# Altium project USB2514_USB_HUB.PrjPcb
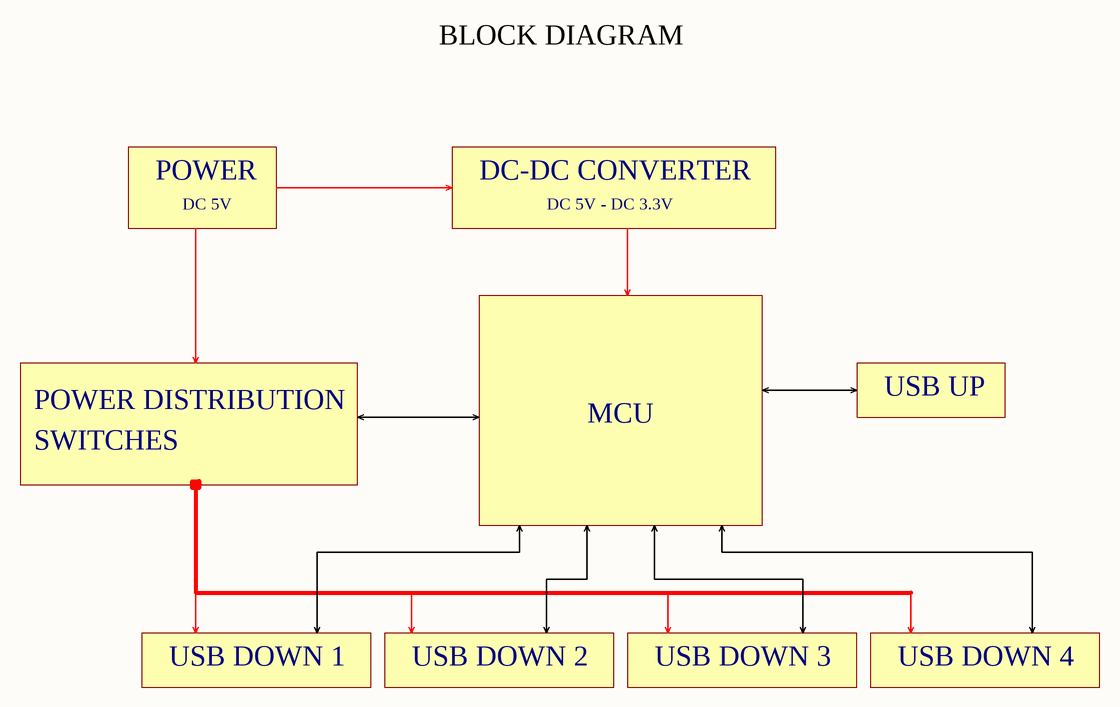
[diagram p0: USB2514 BLOCK DIAGRAM.SchDoc]
6 sheets, 61 parts. Net scope: global (net labels, ports and power ports of the same name join across sheets).
Board files: USB2514 PCB v1.PcbDoc, USB2514 PCB v2.PcbDoc
Sheets:
  USB2514 BLOCK DIAGRAM.SchDoc
  USB2514 MCU.SchDoc
  USB2514 USB PORTS.SchDoc
  USB2514 POWER DISTRIBUTION SWITCHES.SchDoc
  USB2514 REGULATOR.SchDoc
  USB2514 CRYSTAL.SchDoc

## Sheet USB2514 BLOCK DIAGRAM.SchDoc
size A4; DocumentNumber: 1; SheetNumber: 1; SheetTotal: 6

### Notes on the sheet
- BLOCK DIAGRAM
- POWER
- DC-DC CONVERTER
- DC 5V
- DC 5V - DC 3.3V
- USB UP
- POWER DISTRIBUTION
- SWITCHES
- MCU
- USB DOWN 1
- USB DOWN 2
- USB DOWN 3
- USB DOWN 4

## Sheet USB2514 MCU.SchDoc: asdasdasd
size A4; DocumentNumber: 2; SheetNumber: 2; SheetTotal: 6
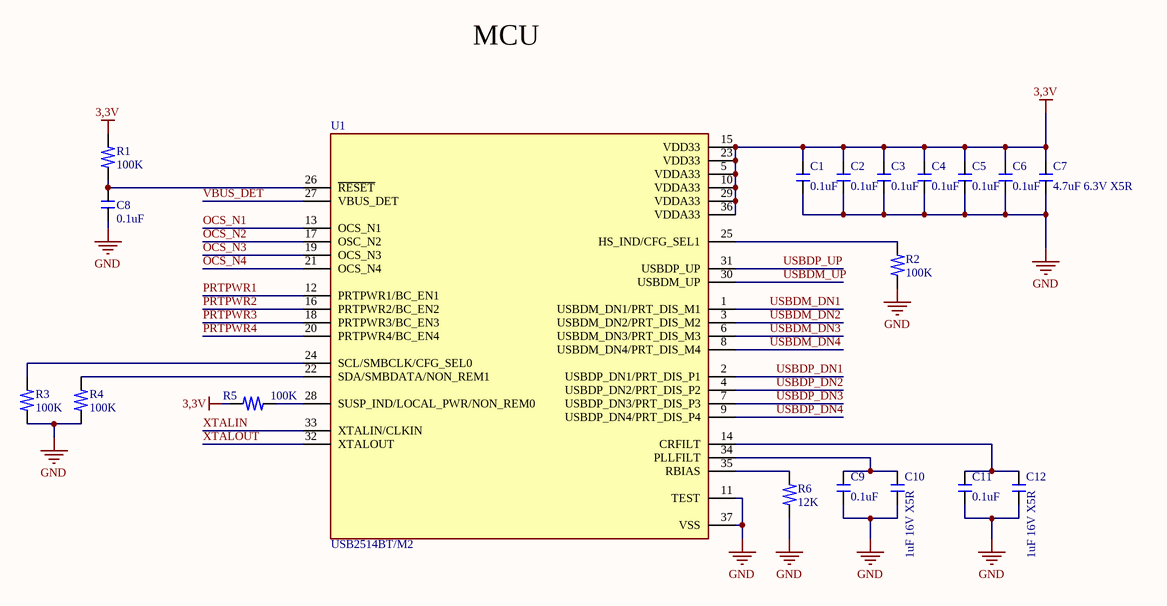
[diagram p1: USB2514 MCU.SchDoc]

### Parts
C1  0.1uF  [CAPC1608X06N-0603]
C2  0.1uF  [CAPC1608X06N-0603]
C3  0.1uF  [CAPC1608X06N-0603]
C4  0.1uF  [CAPC1608X06N-0603]
C5  0.1uF  [CAPC1608X06N-0603]
C6  0.1uF  [CAPC1608X06N-0603]
C7  4.7uF 6.3V X5R  [CAPC1608X06N-0603]
C8  0.1uF  [CAPC1608X06N-0603]
C9  0.1uF  [CAPC1608X06N-0603]
C10  1uF 16V X5R  [CAPC1608X06N-0603]
C11  0.1uF  [CAPC1608X06N-0603]
C12  1uF 16V X5R  [CAPC1608X06N-0603]
R1  100K  [RESC1608X06N-0603]
R2  100K  [RESC1608X06N-0603]
R3  100K  [RESC1608X06N-0603]
R4  100K  [RESC1608X06N-0603]
R5  100K  [RESC1608X06N-0603]
R6  12K  [RESC1608X06N-0603]
U1  USB2514BT/M2  [QFN50P600X600X100_HS-37N]

### Nets
3,3V: C1.2 C2.2 C3.2 C4.2 C5.2 C6.2 C7.2 R1.2 R5.2 U1.5(VDDA33) U1.10(VDDA33) U1.15(VDD33) U1.23(VDD33) U1.29(VDDA33) U1.36(VDDA33)
GND: C1.1 C2.1 C3.1 C4.1 C5.1 C6.1 C7.1 C8.1 C9.1 C10.1 C11.1 C12.1 R2.1 R3.1 R4.1 R6.1 U1.11(TEST) U1.37(VSS)
OCS_N1: U1.13(OCS_N1)
OCS_N2: U1.17(OSC_N2)
OCS_N3: U1.19(OCS_N3)
OCS_N4: U1.21(OCS_N4)
PRTPWR1: U1.12(PRTPWR1/BC_EN1)
PRTPWR2: U1.16(PRTPWR2/BC_EN2)
PRTPWR3: U1.18(PRTPWR3/BC_EN3)
PRTPWR4: U1.20(PRTPWR4/BC_EN4)
USBDM_DN1: U1.1(USBDM_DN1/PRT_DIS_M1)
USBDM_DN2: U1.3(USBDM_DN2/PRT_DIS_M2)
USBDM_DN3: U1.6(USBDM_DN3/PRT_DIS_M3)
USBDM_DN4: U1.8(USBDM_DN4/PRT_DIS_M4)
USBDM_UP: U1.30(USBDM_UP)
USBDP_DN1: U1.2(USBDP_DN1/PRT_DIS_P1)
USBDP_DN2: U1.4(USBDP_DN2/PRT_DIS_P2)
USBDP_DN3: U1.7(USBDP_DN3/PRT_DIS_P3)
USBDP_DN4: U1.9(USBDP_DN4/PRT_DIS_P4)
USBDP_UP: U1.31(USBDP_UP)
VBUS_DET: U1.27(VBUS_DET)
XTALIN: U1.33(XTALIN/CLKIN)
XTALOUT: U1.32(XTALOUT)
NetC8_2: C8.2 R1.1 U1.26(~{RESET})
NetC9_2: C9.2 C10.2 U1.34(PLLFILT)
NetC11_2: C11.2 C12.2 U1.14(CRFILT)
NetR2_2: R2.2 U1.25(HS_IND/CFG_SEL1)
NetR3_2: R3.2 U1.24(SCL/SMBCLK/CFG_SEL0)
NetR4_2: R4.2 U1.22(SDA/SMBDATA/NON_REM1)
NetR5_1: R5.1 U1.28(SUSP_IND/LOCAL_PWR/NON_REM0)
NetR6_2: R6.2 U1.35(RBIAS)

### Notes on the sheet
- MCU

### Library data of the parts
C1-C12 = CAP_0603_0.1uF
R1-R6 = RES_0603_10K
U1 = USB2514BT/M2: USB Hub Controller USB Interface 36-SQFN (6x6); MF: Microchip; Purchase-URL: https://pricing.snapeda.com/search/part/USB2514BT/M2/?ref=eda; Package: VFQFN-36 Microchip; MP: USB2514BT/M2; Check_prices: https://www.snapeda.com/parts/USB2514BT/M2/Microchip/view-part/1051251/?ref=eda; Price: None; SnapEDA_Link: https://www.snapeda.com/parts/USB2514BT/M2/Microchip/view-part/1051251/?ref=snap; Availability: Warning; Value: *

## Sheet USB2514 USB PORTS.SchDoc
size A4; DocumentNumber: 3; SheetNumber: 3; SheetTotal: 6
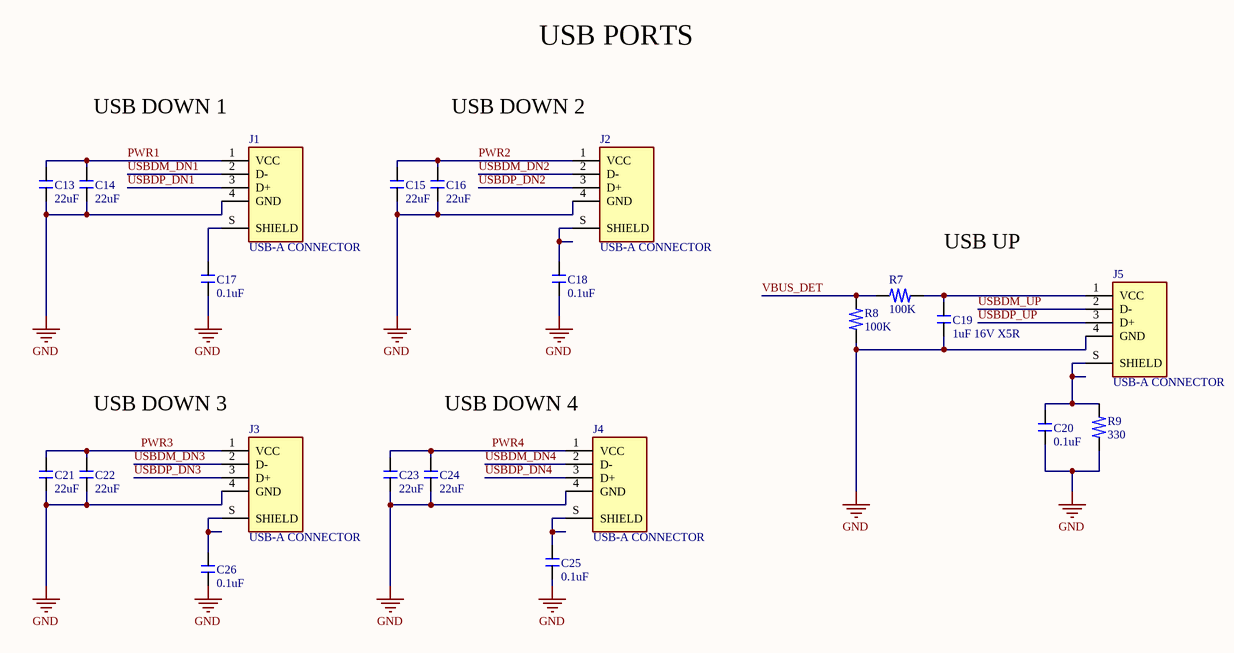
[diagram p2: USB2514 USB PORTS.SchDoc]

### Parts
C13  22uF  [CAPC3216X10N-1206]
C14  22uF  [CAPC3216X10N-1206]
C15  22uF  [CAPC3216X10N-1206]
C16  22uF  [CAPC3216X10N-1206]
C17  0.1uF  [CAPC1608X06N-0603]
C18  0.1uF  [CAPC1608X06N-0603]
C19  1uF 16V X5R  [CAPC1608X06N-0603]
C20  0.1uF  [CAPC1608X06N-0603]
C21  22uF  [CAPC3216X10N-1206]
C22  22uF  [CAPC3216X10N-1206]
C23  22uF  [CAPC3216X10N-1206]
C24  22uF  [CAPC3216X10N-1206]
C25  0.1uF  [CAPC1608X06N-0603]
C26  0.1uF  [CAPC1608X06N-0603]
J1  USB-A CONNECTOR  [USB-U-A-24DS-Y-1]
J2  USB-A CONNECTOR  [USB-U-A-24DS-Y-1]
J3  USB-A CONNECTOR  [USB-U-A-24DS-Y-1]
J4  USB-A CONNECTOR  [USB-U-A-24DS-Y-1]
J5  USB-A CONNECTOR  [USB-U-A-24DS-Y-1]
R7  100K  [RESC1608X06N-0603]
R8  100K  [RESC1608X06N-0603]
R9  330  [RESC1608X06N-0603]

### Nets
GND: C13.1 C14.1 C15.1 C16.1 C17.1 C18.1 C19.1 C20.1 C21.1 C22.1 C23.1 C24.1 C25.1 C26.1 J1.4(GND) J2.4(GND) J3.4(GND) J4.4(GND) J5.4(GND) R8.1 R9.1
PWR1: C13.2 C14.2 J1.1(VCC)
PWR2: C15.2 C16.2 J2.1(VCC)
PWR3: C21.2 C22.2 J3.1(VCC)
PWR4: C23.2 C24.2 J4.1(VCC)
USBDM_DN1: J1.2(D-)
USBDM_DN2: J2.2(D-)
USBDM_DN3: J3.2(D-)
USBDM_DN4: J4.2(D-)
USBDM_UP: J5.2(D-)
USBDP_DN1: J1.3(D+)
USBDP_DN2: J2.3(D+)
USBDP_DN3: J3.3(D+)
USBDP_DN4: J4.3(D+)
USBDP_UP: J5.3(D+)
VBUS_DET: R7.1 R8.2
NetC17_2: C17.2 J1.S(SHIELD)
NetC18_2: C18.2 J2.S(SHIELD)
NetC19_2: C19.2 J5.1(VCC) R7.2
NetC20_2: C20.2 J5.S(SHIELD) R9.2
NetC25_2: C25.2 J4.S(SHIELD)
NetC26_2: C26.2 J3.S(SHIELD)

### Notes on the sheet
- USB PORTS
- USB DOWN 1
- USB DOWN 2
- USB UP
- USB DOWN 3
- USB DOWN 4

### Library data of the parts
C13-C16 C21-C24 = CAP_1206_22uF
C17-C20 C25 C26 = CAP_0603_0.1uF
J1-J5 = USB-U-A-24DS-Y-1: USB-A (USB TYPE-A) USB 2.0; MF: Samtec; MP: USB-A-S-X-X-VU; Price: None; Availability: Unavailable; Value: *; Package: None
R7-R9 = RES_0603_1K

## Sheet USB2514 POWER DISTRIBUTION SWITCHES.SchDoc
size A4; DocumentNumber: 4; SheetNumber: 4; SheetTotal: 6
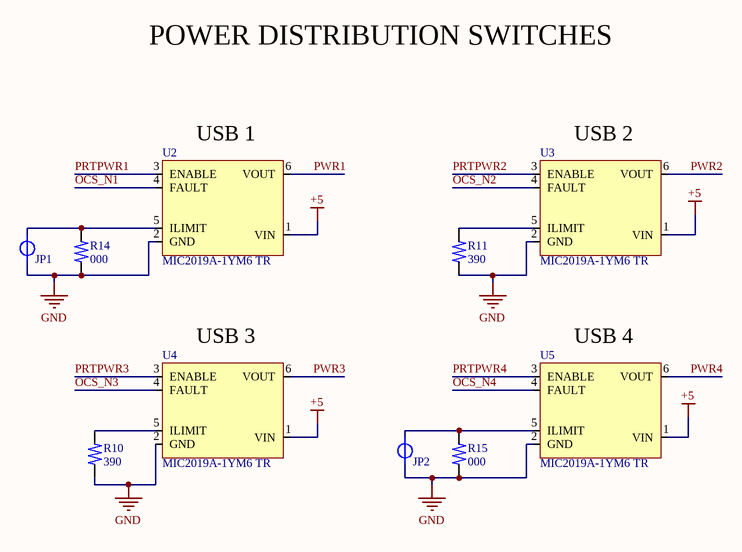
[diagram p3: USB2514 POWER DISTRIBUTION SWITCHES.SchDoc]

### Parts
JP1  JUMP_N-C  [JUMP_N-C 0,254]  (value not drawn)
JP2  JUMP_N-C  [JUMP_N-C 0,254]  (value not drawn)
R10  390  [RESC1608X06N-0603]
R11  390  [RESC1608X06N-0603]
R14  000  [RESC1608X06N-0603]
R15  000  [RESC1608X06N-0603]
U2  MIC2019A-1YM6 TR  [SOT95P280X90-6N]
U3  MIC2019A-1YM6 TR  [SOT95P280X90-6N]
U4  MIC2019A-1YM6 TR  [SOT95P280X90-6N]
U5  MIC2019A-1YM6 TR  [SOT95P280X90-6N]

### Nets
+5: U2.1(VIN) U3.1(VIN) U4.1(VIN) U5.1(VIN)
GND: JP1.1 JP2.1 R10.1 R11.1 R14.1 R15.1 U2.2(GND) U3.2(GND) U4.2(GND) U5.2(GND)
OCS_N1: U2.4(FAULT)
OCS_N2: U3.4(FAULT)
OCS_N3: U4.4(FAULT)
OCS_N4: U5.4(FAULT)
PRTPWR1: U2.3(ENABLE)
PRTPWR2: U3.3(ENABLE)
PRTPWR3: U4.3(ENABLE)
PRTPWR4: U5.3(ENABLE)
PWR1: U2.6(VOUT)
PWR2: U3.6(VOUT)
PWR3: U4.6(VOUT)
PWR4: U5.6(VOUT)
NetJP1_2: JP1.2 R14.2 U2.5(ILIMIT)
NetJP2_2: JP2.2 R15.2 U5.5(ILIMIT)
NetR10_2: R10.2 U4.5(ILIMIT)
NetR11_2: R11.2 U3.5(ILIMIT)

### Notes on the sheet
- POWER DISTRIBUTION SWITCHES
- (near U2) USB 1
- (near U3) USB 2
- (near U4) USB 3
- (near U5) USB 4

### Library data of the parts
R10 R11 R14 R15 = RES_0603_1K

## Sheet USB2514 REGULATOR.SchDoc
size A4; DocumentNumber: 5; SheetNumber: 5; SheetTotal: 6
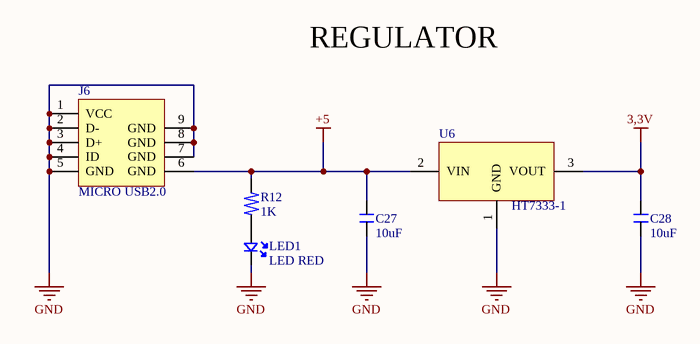
[diagram p4: USB2514 REGULATOR.SchDoc]

### Parts
C27  10uF  [CAPC3216X10N-1206]
C28  10uF  [CAPC3216X10N-1206]
J6  MICRO USB2.0  [USB_CON_10118192-0001LF_SMD]
LED1  LED RED  [LED_0603]
R12  1K  [RESC1608X06N-0603]
U6  HT7333-1  [SOT89-150P350X150-3N]

### Nets
3,3V: C28.2 U6.3(VOUT)
+5: C27.2 J6.6(GND) R12.2 U6.2(VIN)
GND: C27.1 C28.1 J6.1(VCC) J6.2(D-) J6.3(D+) J6.4(ID) J6.5(GND) J6.7(GND) J6.8(GND) J6.9(GND) LED1.C U6.1(GND)
NetLED1_A: LED1.A R12.1

### Notes on the sheet
- REGULATOR

### Library data of the parts
C27 C28 = CAP_1206_22uF
J6 = USB_CON-10118192-0002LF-SMD: USB - micro B USB 2.0 Receptacle Connector 5 Position Surface Mount, Right Angle; Manufacturer: Amphenol ICC (FCI); Manufacturing Part Number: 10118192-0002LF; Case/Package: SMD; Supplier-1: Digikey; Supplier Part Number-1: 609-5379-1-ND
LED1 = LED_RED_0603
R12 = RES_0603_1K
U6 = HT7333-1: HT7333-1 / 30V, 250mA TinyPowerTM LDO

## Sheet USB2514 CRYSTAL.SchDoc
size A4; DocumentNumber: 6; SheetNumber: 6; SheetTotal: 6
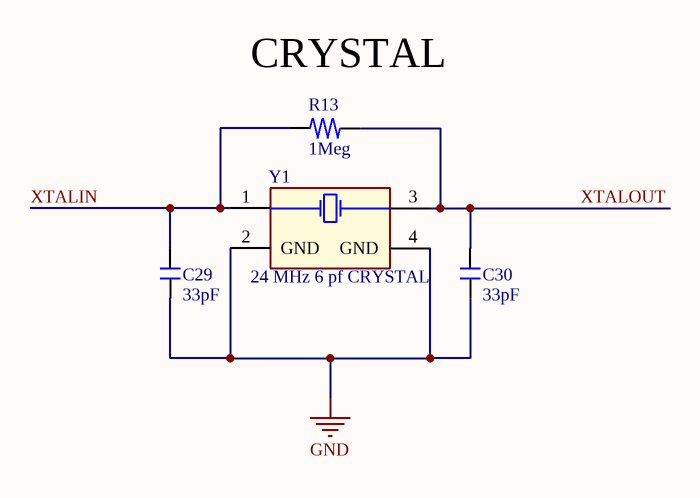
[diagram p5: USB2514 CRYSTAL.SchDoc]

### Parts
C29  33pF  [CAPC1608X06N-0603]
C30  33pF  [CAPC1608X06N-0603]
R13  1Meg  [RESC1608X06N-0603]
Y1  24 MHz 6 pf CRYSTAL  [OSC_XRCGB24M000F2P00R0]

### Nets
GND: C29.1 C30.1 Y1.2(GND) Y1.4(GND)
XTALIN: C29.2 R13.1 Y1.1
XTALOUT: C30.2 R13.2 Y1.3

### Notes on the sheet
- (near R13) CRYSTAL

### Library data of the parts
C29 C30 = CAP_0603_0.1uF
R13 = RES_0603_1K
Y1 = 24 MHz 6 pf CRYSTAL: 8 MHz 12.5 pf Osc

## Nets that join several sheets
3,3V: USB2514 MCU (15 pins), USB2514 REGULATOR (C28.2 U6.3)
+5: USB2514 POWER DISTRIBUTION SWITCHES (U2.1 U3.1 U4.1 U5.1), USB2514 REGULATOR (C27.2 J6.6 R12.2 U6.2)
GND: USB2514 MCU (18 pins), USB2514 USB PORTS (21 pins), USB2514 POWER DISTRIBUTION SWITCHES (10 pins), USB2514 REGULATOR (12 pins), USB2514 CRYSTAL (C29.1 C30.1 Y1.2 Y1.4)
OCS_N1: USB2514 MCU (U1.13), USB2514 POWER DISTRIBUTION SWITCHES (U2.4)
OCS_N2: USB2514 MCU (U1.17), USB2514 POWER DISTRIBUTION SWITCHES (U3.4)
OCS_N3: USB2514 MCU (U1.19), USB2514 POWER DISTRIBUTION SWITCHES (U4.4)
OCS_N4: USB2514 MCU (U1.21), USB2514 POWER DISTRIBUTION SWITCHES (U5.4)
PRTPWR1: USB2514 MCU (U1.12), USB2514 POWER DISTRIBUTION SWITCHES (U2.3)
PRTPWR2: USB2514 MCU (U1.16), USB2514 POWER DISTRIBUTION SWITCHES (U3.3)
PRTPWR3: USB2514 MCU (U1.18), USB2514 POWER DISTRIBUTION SWITCHES (U4.3)
PRTPWR4: USB2514 MCU (U1.20), USB2514 POWER DISTRIBUTION SWITCHES (U5.3)
PWR1: USB2514 USB PORTS (C13.2 C14.2 J1.1), USB2514 POWER DISTRIBUTION SWITCHES (U2.6)
PWR2: USB2514 USB PORTS (C15.2 C16.2 J2.1), USB2514 POWER DISTRIBUTION SWITCHES (U3.6)
PWR3: USB2514 USB PORTS (C21.2 C22.2 J3.1), USB2514 POWER DISTRIBUTION SWITCHES (U4.6)
PWR4: USB2514 USB PORTS (C23.2 C24.2 J4.1), USB2514 POWER DISTRIBUTION SWITCHES (U5.6)
USBDM_DN1: USB2514 MCU (U1.1), USB2514 USB PORTS (J1.2)
USBDM_DN2: USB2514 MCU (U1.3), USB2514 USB PORTS (J2.2)
USBDM_DN3: USB2514 MCU (U1.6), USB2514 USB PORTS (J3.2)
USBDM_DN4: USB2514 MCU (U1.8), USB2514 USB PORTS (J4.2)
USBDM_UP: USB2514 MCU (U1.30), USB2514 USB PORTS (J5.2)
USBDP_DN1: USB2514 MCU (U1.2), USB2514 USB PORTS (J1.3)
USBDP_DN2: USB2514 MCU (U1.4), USB2514 USB PORTS (J2.3)
USBDP_DN3: USB2514 MCU (U1.7), USB2514 USB PORTS (J3.3)
USBDP_DN4: USB2514 MCU (U1.9), USB2514 USB PORTS (J4.3)
USBDP_UP: USB2514 MCU (U1.31), USB2514 USB PORTS (J5.3)
VBUS_DET: USB2514 MCU (U1.27), USB2514 USB PORTS (R7.1 R8.2)
XTALIN: USB2514 MCU (U1.33), USB2514 CRYSTAL (C29.2 R13.1 Y1.1)
XTALOUT: USB2514 MCU (U1.32), USB2514 CRYSTAL (C30.2 R13.2 Y1.3)